# EAGLE design parent-board (EAGLE 9.4.2)
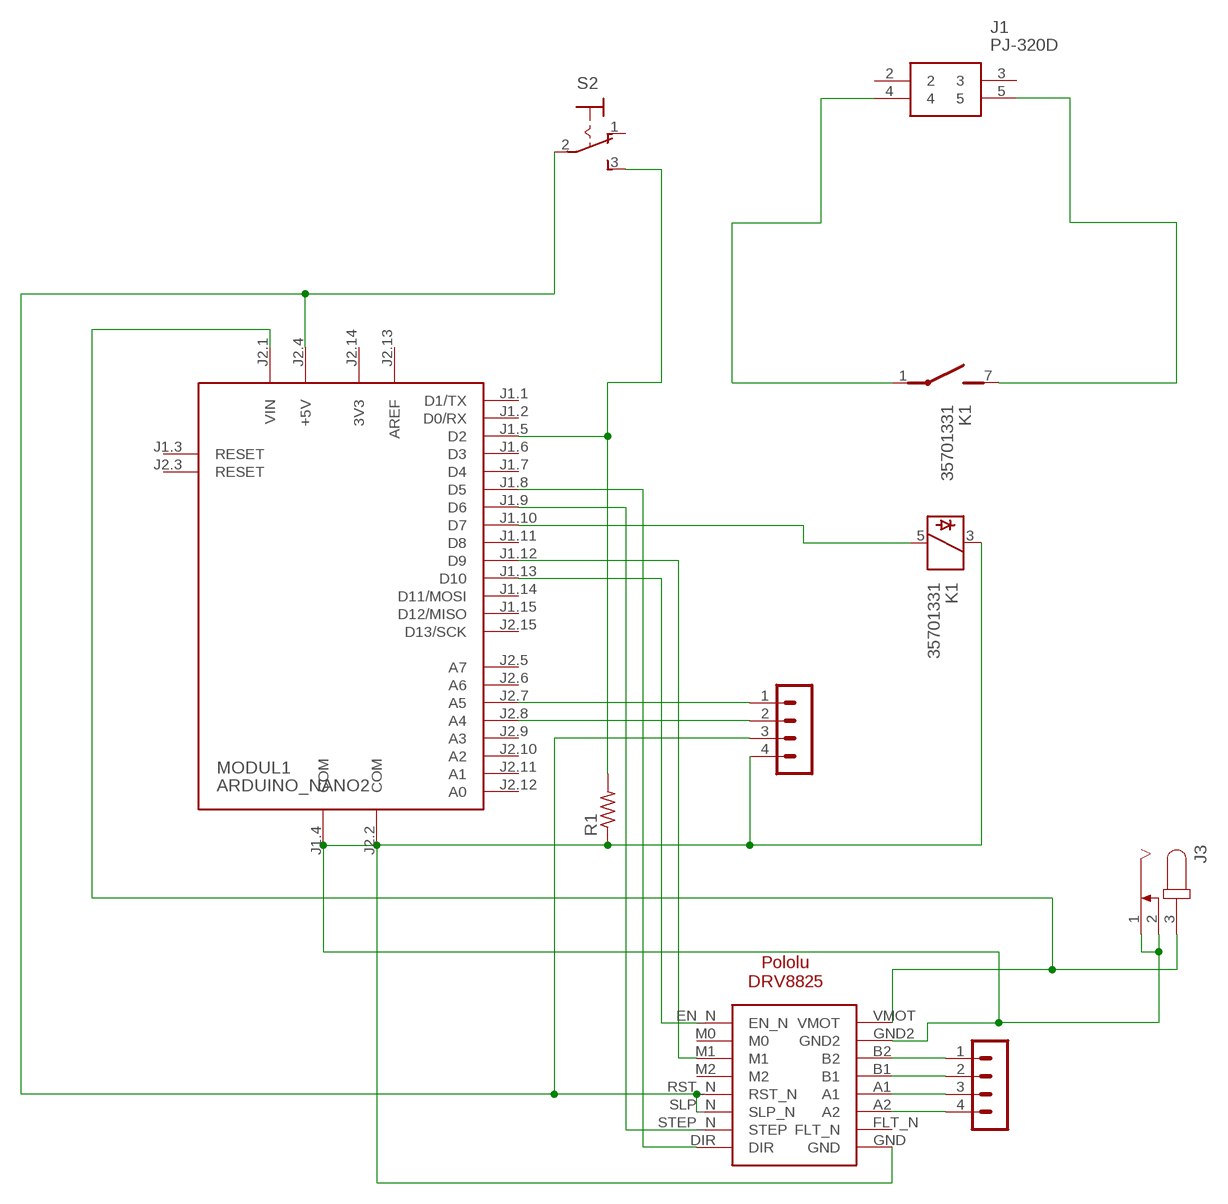
[diagram p0: schematic, sheet 1]

## Parts
J1  PJ-320D  [PJ320D]
J2  MA04-1  [MA04-1]
J3  JACK-PLUG0  [SPC4077]
J4  MA04-1  [MA04-1]
K1  35701331  [REED]
MODUL1  ARDUINO_NANO2  [ARDUINO_NANO2]
R1  R-US_M1206  [M1206]
S2  320-916  [320-916]
U$1  POLOLU-DRV8825  [POLOLU-DRV8825]

## Nets
N$1: J1.4 K1.1(2:P)
N$2: J1.5 K1.7(2:S)
N$3: K1.5 MODUL1.J1.10(D7)
N$4: J2.3 U$1.A1
N$5: J2.2 U$1.B1
N$6: MODUL1.J1.5(D2) R1.2 S2.3(S)
N$7: MODUL1.J1.9(D6) U$1.STEP_N(STEP)
N$8: MODUL1.J1.8(D5) U$1.DIR
N$9: J2.1 U$1.B2
N$10: J4.1 MODUL1.J2.7(A5)
N$11: J4.2 MODUL1.J2.8(A4)
N$12: J2.4 U$1.A2
N$13: J3.3 MODUL1.J2.1(VIN) U$1.VMOT
N$14: J3.1 J3.2 J4.4 K1.3 MODUL1.J1.4(COM) MODUL1.J2.2(COM) R1.1 U$1.GND U$1.GND2
N$15: J4.3 MODUL1.J2.4(+5V) S2.2(P) U$1.RST_N U$1.SLP_N
N$16: MODUL1.J1.13(D10) U$1.EN_N
N$17: MODUL1.J1.12(D9) U$1.M1
Unconnected: J1.2 J1.3 MODUL1.J1.1(D1/TX) MODUL1.J1.2(D0/RX) MODUL1.J1.3(RESET) MODUL1.J1.6(D3) MODUL1.J1.7(D4) MODUL1.J1.11(D8) MODUL1.J1.14(D11/MOSI) MODUL1.J1.15(D12/MISO) MODUL1.J2.3(RESET) MODUL1.J2.5(A7) MODUL1.J2.6(A6) MODUL1.J2.9(A3) MODUL1.J2.10(A2) MODUL1.J2.11(A1) MODUL1.J2.12(A0) MODUL1.J2.15(D13/SCK) S2.1(O) U$1.FLT_N U$1.M0 U$1.M2

## Power pins joined to a net without a drawn wire
3V3: MODUL1.J2.14(3V3)
AREF: MODUL1.J2.13(AREF)

## Library data of the parts
J1 = PJ-320D:PJ-320D: Phone Jack Source: Datasheet <https://p.globalsources.com/IMAGES/PDT/SPEC/432/K1007154432.pdf>; DESCRIPTION: Phone Jack; HEIGHT: 5.6mm; MANUFACTURER_NAME: Audio-Technica; MANUFACTURER_PART_NUMBER: PJ-320D
J2 J4 = con-lstb:MA04-1: PIN HEADER; OC_FARNELL: unknown; OC_NEWARK: unknown
J3 = con-jack:JACK-PLUG: DC POWER JACK Power Jack, DC, Right Angle, Through Hole, Rated 5A at 16VDC, PC Terminals Distributor: Farnell (www.Farnell.de) Drawing: 84N1161.pdf / 84N1162.pdf Manufacturer: SPC Technology (www.spctechnology.com) Type: SPC4077 / SPC 4078; OC_FARNELL: unknown; OC_NEWARK: unknown
K1 = relay:35701331: RELAY reed, 1 x norm. open with polarity; OC_FARNELL: unknown; OC_NEWARK: unknown
MODUL1 = arduino:ARDUINO_NANO2: Arduino Nano2 Auto generated by modulcreator.ulp \;; ANZAHL: 2; MODUL: TRUE; STECKX0: -76200; STECKX1: 76200; STECKY0: 177800; STECKY1: 177800
R1 = adafruit:R-US_: RESISTOR, American symbol
S2 = switch:320-916: TOGGLE SWITCH distributor RS Components
U$1 = alvarop-lib:POLOLU-DRV8825

## Board
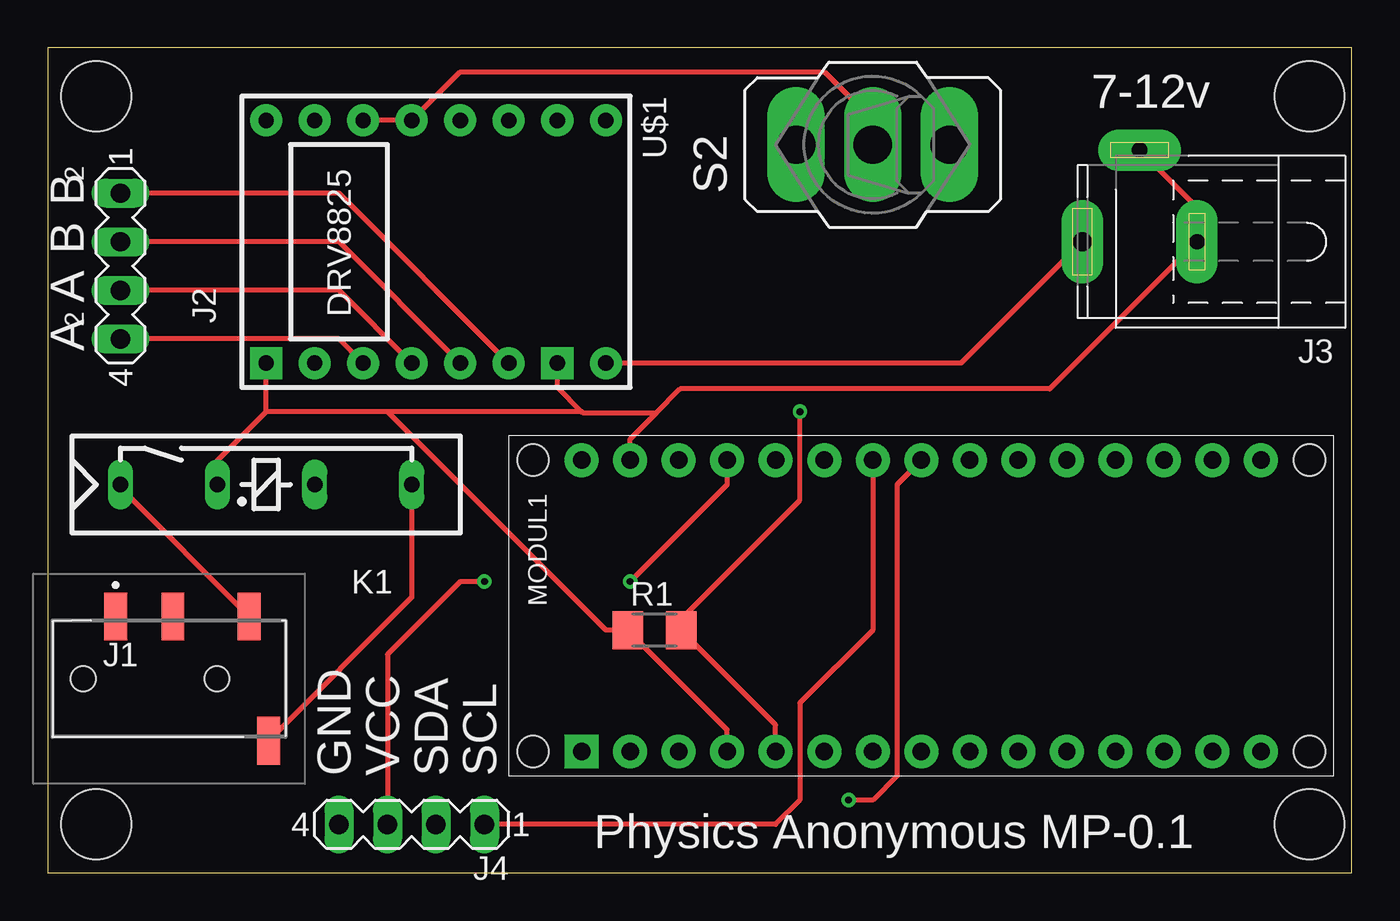
[diagram p1: board, top side]
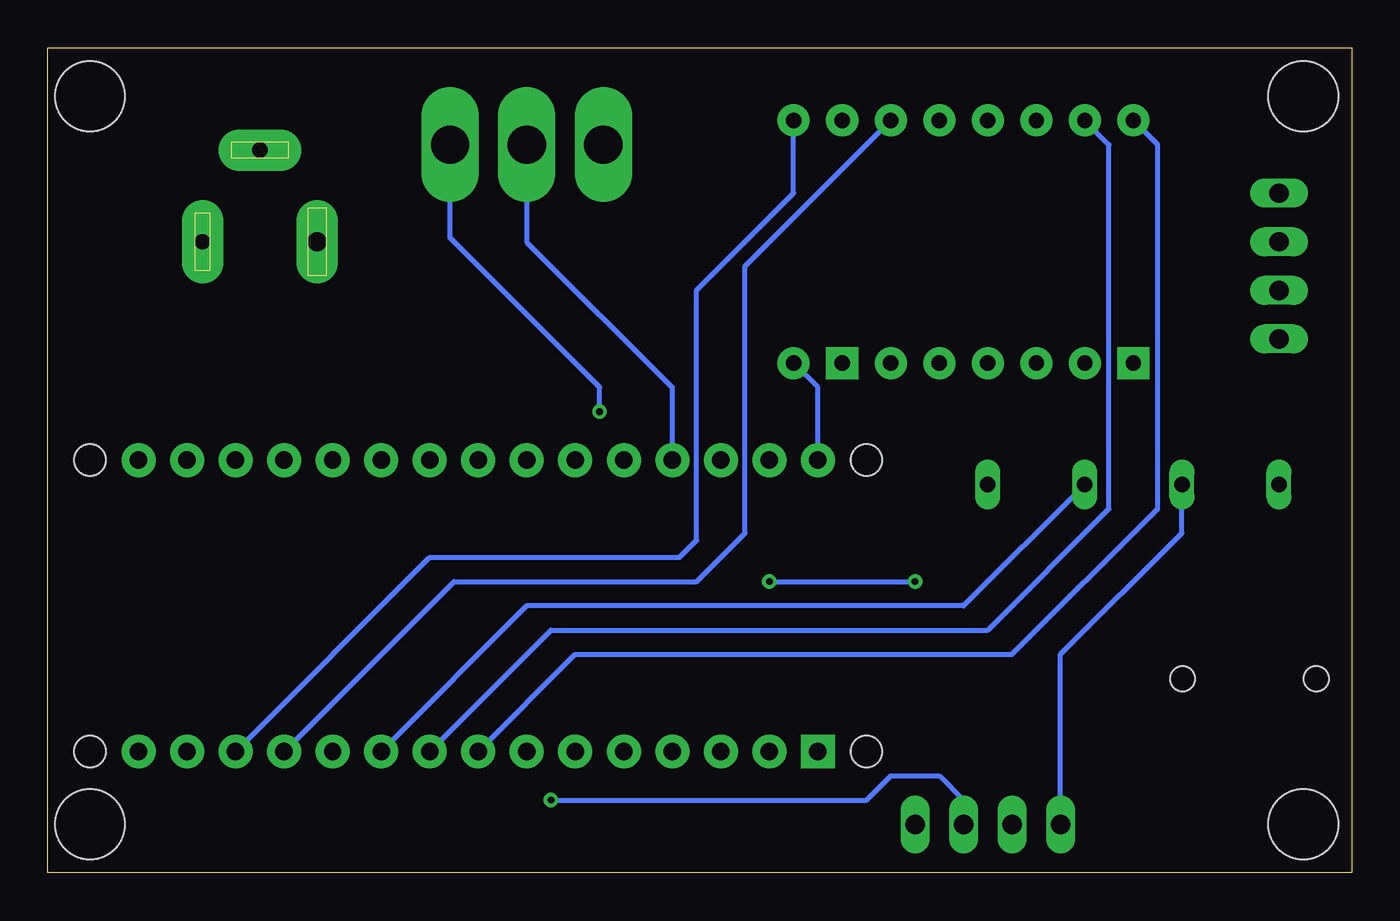
[diagram p2: board, bottom side, seen from below]

Size 68.25 x 43.17 mm. Coordinates in mm from the lower left corner, seen from the top.
Outline: 0,0 68.25,0 68.25,43.17 0,43.17 0,0
Copper layers (1*16): Top 0.035mm / dielectric 1.5mm / Bottom 0.035mm
Design rules "default": minimum track width 6mil, minimum drill 0.35mm, track to track 6mil, track to pad 6mil, pad to pad 6mil, via to via 6mil, smd to smd 6mil, copper to edge 40mil, drill to drill 6mil, minimum pad ring 10mil, minimum via ring 8mil, stop-mask expansion 4mil, vias tented up to drill 0mil, thermal gap 10mil
Holes 3.66 mm at 2.54,2.54 2.54,40.64 66.04,40.64 66.04,2.54

### Footprints (pad centres in the part's own frame; a part is rotated, then mirrored left to right if it is on the bottom)
PJ320D = smd 1.2 x 2.5: 2 -2.8,3.25; 3 0.2,3.25; 4 4.2,3.25; 5 5.2,-3.25 | hole 1.3: -4.5,0; 2.5,0
MA04-1 = drill 1.016 long: 1 -3.81,0; 2 -1.27,0; 3 1.27,0; 4 3.81,0
SPC4077 = drill 0.8 pad 2.184 long: 1 -3,0; 2 0,-4.8 | drill 1 pad 2.184 long: 3 3,0
REED = drill 0.813 long: 1 -17.78,2.54; 3 -12.7,2.54; 5 -7.62,2.54; 7 -2.54,2.54
ARDUINO_NANO2 = drill 0.914 pad 1.778 square: J1.1 -7.62,17.78 | drill 0.914 pad 1.778: J1.2 -7.62,15.24; J1.3 -7.62,12.7; J1.4 -7.62,10.16; J1.5 -7.62,7.62; J1.6 -7.62,5.08; J1.7 -7.62,2.54; J1.8 -7.62,0; J1.9 -7.62,-2.54; J1.10 -7.62,-5.08; J1.11 -7.62,-7.62; J1.12 -7.62,-10.16; J1.13 -7.62,-12.7; J1.14 -7.62,-15.24; J1.15 -7.62,-17.78; J2.1 7.62,17.78; J2.2 7.62,15.24; J2.3 7.62,12.7; J2.4 7.62,10.16; J2.5 7.62,7.62; J2.6 7.62,5.08; J2.7 7.62,2.54; J2.8 7.62,0; J2.9 7.62,-2.54; J2.10 7.62,-5.08; J2.11 7.62,-7.62; J2.12 7.62,-10.16; J2.13 7.62,-12.7; J2.14 7.62,-15.24; J2.15 7.62,-17.78 | hole 1.651: -7.62,-20.32; 7.62,-20.32; 7.62,20.32; -7.62,20.32
M1206 = smd 1.6 x 2: 1 -1.4,0; 2 1.4,0
320-916 = drill 2.007 long: 1 0,4.013; 2 0,0; 3 0,-4.013
POLOLU-DRV8825 = drill 0.8 pad 1.676: A1 6.35,-1.27; A2 6.35,-3.81; B1 6.35,1.27; B2 6.35,3.81; DIR -6.35,-8.89; EN_N -6.35,8.89; FLT_N 6.35,-6.35; M0 -6.35,6.35; M1 -6.35,3.81; M2 -6.35,1.27; RST_N -6.35,-1.27; SLP_N -6.35,-3.81; STEP_N -6.35,-6.35; VMOT 6.35,8.89 | drill 0.8 pad 1.676 square: GND 6.35,-8.89; GND2 6.35,6.35

### Placement (x,y rotation side)
J1  6.35,10.16 0 top
J2  3.81,31.75 270 top
J3  57.15,33.02 180 top
J4  19.05,2.54 180 top
K1  21.59,17.78 0 top
MODUL1  45.72,13.97 90 top
R1  31.75,12.7 0 top
S2  43.18,38.1 90 top
U$1  20.32,33.02 270 top

### Tracks (layer width: path | path; a pad name or v marks a point on that pad's centre or on a via)
N$1
  Top 0.254: J1.4 3.81,20.15 K1.1
N$2
  Top 0.254: K1.7 19.05,14.41 J1.5
N$3
  Bottom 0.254: K1.5 20.32,13.97 43.18,13.97 MODUL1.J1.10
N$4
  Top 0.254: U$1.A1 15.24,30.48 J2.3
N$5
  Top 0.254: U$1.B1 15.24,33.02 J2.2
N$6  (via drill 0.35)
  Top 0.254: MODUL1.J1.5 38.1,7.75 R1.2 32.86,12.99 39.37,19.51 v39.37,24.13
  Bottom 0.254: v39.37,24.13 39.37,25.4 47.19,33.22 S2.3
N$7
  Bottom 0.254: MODUL1.J1.9 41.91,12.7 19.05,12.7 12.7,19.05 12.7,38.1 U$1.STEP_N
N$8
  Bottom 0.254: U$1.DIR 10.16,38.1 10.16,19.05 17.78,11.43 40.64,11.43 MODUL1.J1.8
N$9
  Top 0.254: U$1.B2 15.24,35.56 J2.1
N$10
  Top 0.254: MODUL1.J2.7 43.18,12.7 39.37,8.89 39.37,3.81 38.1,2.54 J4.1
N$11  (via drill 0.35)
  Top 0.254: MODUL1.J2.8 44.45,20.32 44.45,5.08 43.18,3.81 v41.91,3.81
  Bottom 0.254: v41.91,3.81 25.4,3.81 24.13,5.08 21.59,5.08 20.32,3.81 J4.2
N$12
  Top 0.254: U$1.A2 15.24,27.94 J2.4
N$13
  Top 0.254: J3.3 47.8,26.67 U$1.VMOT
  Bottom 0.254: MODUL1.J2.1 27.94,25.4 U$1.VMOT
N$14
  Top 0.254: 31.83,24.05 28.02,24.05 27.94,24.13 | 17.78,24.13 29.21,12.7 R1.1 35.56,7.49 MODUL1.J1.4 | 11.43,24.13 8.89,21.59 K1.3 | 17.78,24.13 11.43,24.13 | 31.83,24.05 30.48,22.7 MODUL1.J2.2 | 31.83,24.05 33.1,25.32 52.45,25.32 J3.1 60.15,34.82 J3.2 | 27.94,24.13 17.78,24.13 | 11.43,24.13 U$1.GND | 27.94,24.13 26.67,25.4 U$1.GND2
  Bottom 0.254: J4.4 15.24,11.43 8.89,17.78 K1.3
N$15  (via drill 0.35)
  Top 0.254: U$1.SLP_N U$1.RST_N 21.59,41.91 40.64,41.91 43.18,39.37 S2.2 | MODUL1.J2.4 35.56,20.32 v30.48,15.24 | J4.3 17.78,11.43 21.59,15.24 v22.86,15.24
  Bottom 0.254: MODUL1.J2.4 35.56,25.38 43.18,33.01 S2.2 | v30.48,15.24 v22.86,15.24
N$16
  Bottom 0.254: MODUL1.J1.13 48.26,16.51 35.18,16.51 34.29,17.4 34.29,30.48 29.21,35.56 U$1.EN_N
N$17
  Bottom 0.254: MODUL1.J1.12 46.99,15.24 34.29,15.24 31.75,17.78 31.75,31.75 U$1.M1

### Text on the board
tNames: 7-12v | 2 | B | B | A | 2 | A | GND | VCC | SDA | SCL | Physics Anonymous MP-0.1